# Altium schematic sheet Connector.SchDoc
size A4; SheetNumber: 3; SheetTotal: 3
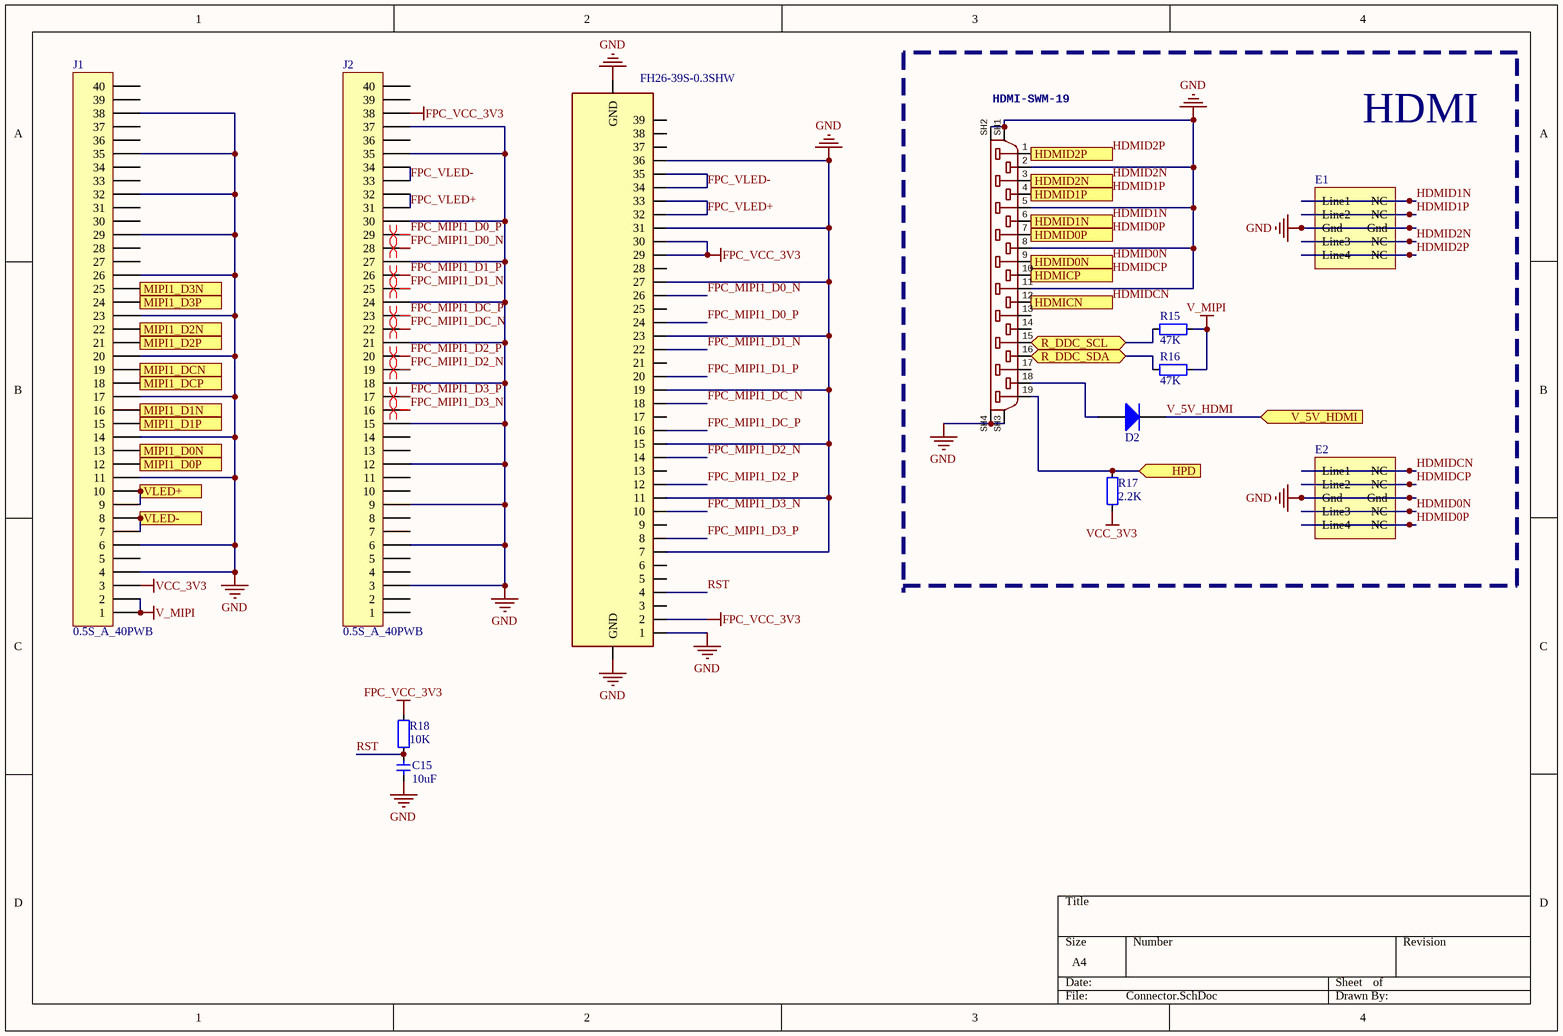
[diagram p0: Connector.SchDoc]

## Parts
1  FH26-39S-0.3SHW  [FH26-39S-0.3SHW]
C15  10uF  [CAP_0402]
D2  二极管-5B5817WS  [SOD-323]  (value not drawn)
E1  E?  [DFN-2510]  (value not drawn)
E2  E?  [DFN-2510]  (value not drawn)
HDMI?  HDMI-SWM-19  [HDMI-SWM-19]
J1  0.5S_A_40PWB  [FFC_0.5_40]
J2  0.5S_A_40PWB  [FFC_0.5_40]
R15  47K  [RES_0402]
R16  47K  [RES_0402]
R17  2.2K  [RES_0402]
R18  10K  [RES_0402]

## Ports
HDMICN (out), HDMICP (out), HDMID0N (out), HDMID0P (out), HDMID1N (out), HDMID1P (out), HDMID2N (out), HDMID2P (out), HPD (in), MIPI1_D0N (in), MIPI1_D0P (in), MIPI1_D1N (in), MIPI1_D1P (in), MIPI1_D2N (in), MIPI1_D2P (in), MIPI1_D3N (in), MIPI1_D3P (in), MIPI1_DCN (in), MIPI1_DCP (in), R_DDC_SCL (bidir), R_DDC_SDA (bidir), V_5V_HDMI (in), VLED+, VLED-

## Nets
FPC_VCC_3V3: 1.2 1.29 1.30 J2.38 R18.2
GND: 1.1 1.7 1.11 1.15 1.19 1.23 1.27 1.31 1.36 1.GND1(GND) 1.GND2(GND) C15.1 E1.3(Gnd) E1.8(Gnd) E2.3(Gnd) E2.8(Gnd) HDMI?.2 HDMI?.5 HDMI?.8 HDMI?.11 HDMI?.SH1 HDMI?.SH2 HDMI?.SH3 HDMI?.SH4 J1.4 J1.6 J1.11 J1.14 J1.17 J1.20 J1.23 J1.26 J1.29 J1.32 J1.35 J1.38 J2.3 J2.6 J2.9 J2.12 J2.15 J2.18 J2.21 J2.24 J2.27 J2.30 J2.35 J2.37
V_MIPI: J1.1 J1.2 R15.2 R16.2
VCC_3V3: J1.3 R17.1
FPC_MIPI1_D0_N: 1.26 J2.28
FPC_MIPI1_D0_P: 1.24 J2.29
FPC_MIPI1_D1_N: 1.22 J2.25
FPC_MIPI1_D1_P: 1.20 J2.26
FPC_MIPI1_D2_N: 1.14 J2.19
FPC_MIPI1_D2_P: 1.12 J2.20
FPC_MIPI1_D3_N: 1.10 J2.16
FPC_MIPI1_D3_P: 1.8 J2.17
FPC_MIPI1_DC_N: 1.18 J2.22
FPC_MIPI1_DC_P: 1.16 J2.23
FPC_VLED+: 1.32 1.33 J2.31 J2.32
FPC_VLED-: 1.34 1.35 J2.33 J2.34
HDMID0N: E2.4(Line3) E2.7(NC) HDMI?.9 ; port HDMID0N
HDMID0P: E2.5(Line4) E2.6(NC) HDMI?.7 ; port HDMID0P
HDMID1N: E1.1(Line1) E1.10(NC) HDMI?.6 ; port HDMID1N
HDMID1P: E1.2(Line2) E1.9(NC) HDMI?.4 ; port HDMID1P
HDMID2N: E1.4(Line3) E1.7(NC) HDMI?.3 ; port HDMID2N
HDMID2P: E1.5(Line4) E1.6(NC) HDMI?.1 ; port HDMID2P
HDMIDCN: E2.1(Line1) E2.10(NC) HDMI?.12 ; port HDMICN
HDMIDCP: E2.2(Line2) E2.9(NC) HDMI?.10 ; port HDMICP
HPD: HDMI?.19 R17.2 ; port HPD
MIPI1_D0N: J1.13 ; port MIPI1_D0N
MIPI1_D0P: J1.12 ; port MIPI1_D0P
MIPI1_D1N: J1.16 ; port MIPI1_D1N
MIPI1_D1P: J1.15 ; port MIPI1_D1P
MIPI1_D2N: J1.22 ; port MIPI1_D2N
MIPI1_D2P: J1.21 ; port MIPI1_D2P
MIPI1_D3N: J1.25 ; port MIPI1_D3N
MIPI1_D3P: J1.24 ; port MIPI1_D3P
MIPI1_DCN: J1.19 ; port MIPI1_DCN
MIPI1_DCP: J1.18 ; port MIPI1_DCP
R_DDC_SCL: HDMI?.15 R15.1 ; port R_DDC_SCL
R_DDC_SDA: HDMI?.16 R16.1 ; port R_DDC_SDA
RST: 1.4 C15.2 R18.1
V_5V_HDMI: D2.2(K) ; port V_5V_HDMI
VLED+: J1.9 J1.10 ; port VLED+
VLED-: J1.7 J1.8 ; port VLED-
NetD2_1: D2.1(A) HDMI?.18

Not connected (* = marked no-connect by the designer): 1 3 5 6 9 13 17 21 25 28 37 38 39; HDMI? 13 14 17; J1 5 27 28 30 31 33 34 36 37 39 40; J2 1 2 4 5 7 8 10 11 13 14 36 39 40

## Layout directives
differential pair: FPC_MIPI1_D0_N, FPC_MIPI1_D0_P, FPC_MIPI1_D1_N, FPC_MIPI1_D1_P, FPC_MIPI1_D2_N, FPC_MIPI1_D2_P, FPC_MIPI1_D3_N, FPC_MIPI1_D3_P, FPC_MIPI1_DC_N, FPC_MIPI1_DC_P

## Notes on the sheet
- HDMI

## Library data of the parts
1 = FH26-39S-0.3SHW: 39 Position FPC Connector Contacts, Bottom 0.012 _0.30mm_ Surface Mount, Right Angle; MF: Hirose; Package: None; Value: *; Availability: Unavailable; MP: FH26-39S-0.3SHW; SnapEDA_Link: https://www.snapeda.com/parts/FH26-39S-0.3SHW/Hirose/view-part/44187/?ref=snap; Price: None
C15 = 电容-0402: Capacitor; Value: 0.1u
D2 = 二极管-5B5817WS: 40V
E1 E2 = AZ1045-04F
HDMI? = HDMI-MC34931HDMI-SWM-19
J1 J2 = FPC40-0.5mm: Header, 40-Pin; LatestRevisionDate: 17-Jul-2002; LatestRevisionNote: Re-released for DXP Platform.; Publisher: Altium Limited
R15-R18 = 电阻-0402: Resistor; Value: 22R